# Altium schematic sheet MINIRACER-IMU.SchDoc
size A4; PageSetup: Record=PageOptions|CenterHorizontal=True|CenterVertical=True|PrintScale=0.97|XCorrection=1.00|YCorrection=1.00|PrintKind=2|BorderSize=5000000|LeftOffset=0|BottomOffset=0|Orientation=2|PaperLength=1000|PaperWidth=1000|Scale=100|PaperSource=7|PrintQuality=-4|MediaType=1|DitherType=10|PaperKind=A4|PrintScaleMode=1
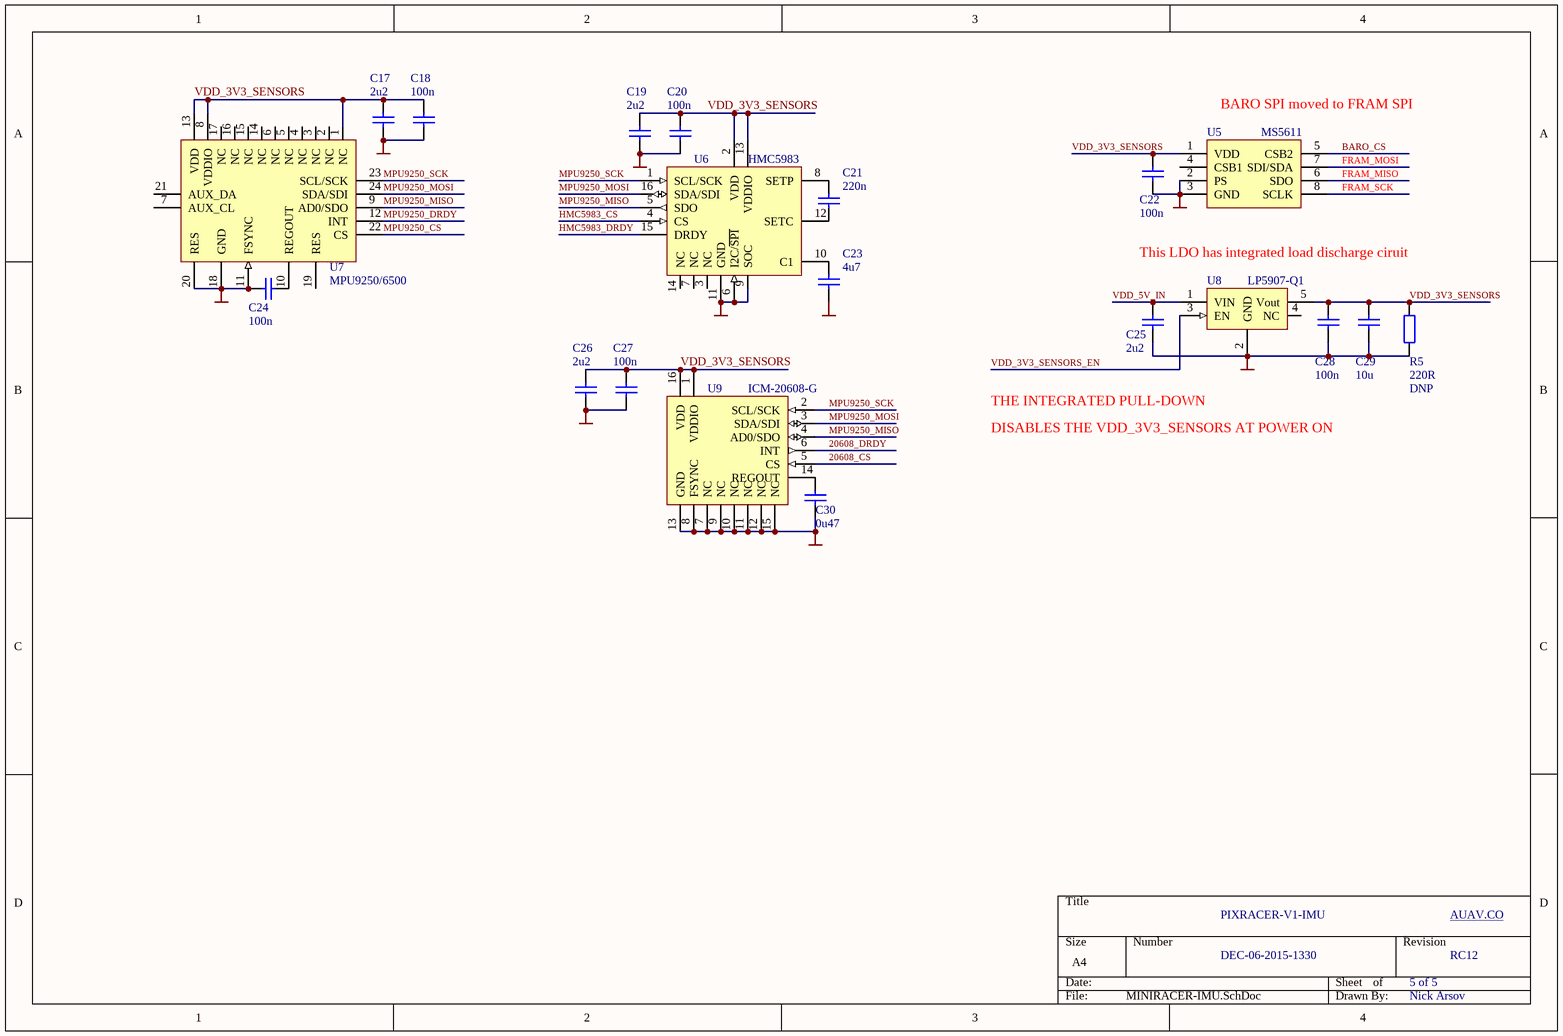
[diagram p0: MINIRACER-IMU.SchDoc]

## Parts
C17  2u2  [0402A]
C18  100n  [0402A]
C19  2u2  [0402A]
C20  100n  [0402A]
C21  220n  [0402A]
C22  100n  [0402A]
C23  4u7  [0603A]
C24  100n  [0402A]
C25  2u2  [0603A]
C26  2u2  [0402A]
C27  100n  [0402A]
C28  100n  [0603A]
C29  10u  [0603A]
C30  0u47  [0402A]
R5  220R  REM: DNP  [0402A]
U5  MS5611  [MS5611]
U6  HMC5983  [HMC5883L]
U7  MPU9250/6500  [MPU6500-9250]
U8  LP5907-Q1  [SOT23-5]
U9  ICM-20608-G  [HCLGA-16L]

## Nets
GND: C17.1 C18.1 C19.1 C20.1 C22.1 C23.1 C24.1 C25.1 C26.1 C27.1 C28.1 C29.1 C30.1 R5.1 U5.2(PS) U5.3(GND) U6.6(I2C/~{SPI}) U6.9(SOC) U6.11(GND) U7.11(FSYNC) U7.18(GND) U7.20(RES) U8.2(GND) U9.7(NC) U9.8(FSYNC) U9.9(NC) U9.10(NC) U9.11(NC) U9.12(NC) U9.13(GND) U9.15(NC)
20608_CS: U9.5(CS)
20608_DRDY: U9.6(INT)
BARO_CS: U5.5(CSB2)
FRAM_MISO: U5.6(SDO)
FRAM_MOSI: U5.7(SDI/SDA)
FRAM_SCK: U5.8(SCLK)
HMC5983_CS: U6.4(CS)
HMC5983_DRDY: U6.15(DRDY)
MPU9250_CS: U7.22(CS)
MPU9250_DRDY: U7.12(INT)
MPU9250_MISO: U6.5(SDO) U7.9(AD0/SDO) U9.4(AD0/SDO)
MPU9250_MOSI: U6.16(SDA/SDI) U7.24(SDA/SDI) U9.3(SDA/SDI)
MPU9250_SCK: U6.1(SCL/SCK) U7.23(SCL/SCK) U9.2(SCL/SCK)
VDD_3V3_SENSORS: C17.2 C18.2 C19.2 C20.2 C22.2 C26.2 C27.2 C28.2 C29.2 R5.2 U5.1(VDD) U6.2(VDD) U6.13(VDDIO) U7.1(NC) U7.8(VDDIO) U7.13(VDD) U8.5(Vout) U9.1(VDDIO) U9.16(VDD)
VDD_3V3_SENSORS_EN: U8.3(EN)
VDD_5V_IN: C25.2 U8.1(VIN)
NetC21_1: C21.1 U6.12(SETC)
NetC21_2: C21.2 U6.8(SETP)
NetC23_2: C23.2 U6.10(C1)
NetC24_2: C24.2 U7.10(REGOUT)
NetC30_2: C30.2 U9.14(REGOUT)

Not connected (* = marked no-connect by the designer): U5 4(CSB1); U6 3(NC) 7(NC) 14(NC); U7 2(NC) 3(NC) 4(NC) 5(NC) 6(NC) 7(AUX_CL) 14(NC) 15(NC) 16(NC) 17(NC) 19(RES) 21(AUX_DA); U8 4(NC)

## Notes on the sheet
- (near U5) BARO SPI moved to FRAM SPI
- This LDO has integrated load discharge ciruit
- THE INTEGRATED PULL-DOWN
- DISABLES THE VDD_3V3_SENSORS AT POWER ON
- PIXRACER-V1-IMU
- AUAV.CO
- DEC-06-2015-1330
- 5 of 5
- RC12
- Nick Arsov

## Library data of the parts
C17-C30 = Cap: Capacitor; Value: 100pF; Published: 8-Jun-2000; LatestRevisionDate: 17-Jul-2002; LatestRevisionNote: Re-released for DXP Platform.; PackageReference: RAD-0.3; Publisher: Altium Limited
R5 = Res2: Resistor; Value: 1K; Published: 8-Jun-2000; LatestRevisionDate: 17-Jul-2002; LatestRevisionNote: Re-released for DXP Platform.; PackageReference: AXIAL-0.4; Publisher: Altium Limited; PackageDescription: Axial Device, Thru-Hole; 2 Leads; 0.4 in Pin Spacing
U5 = MS5611-01BA03
U7 = MPU6500